# Altium project 电机控制.PrjPCB
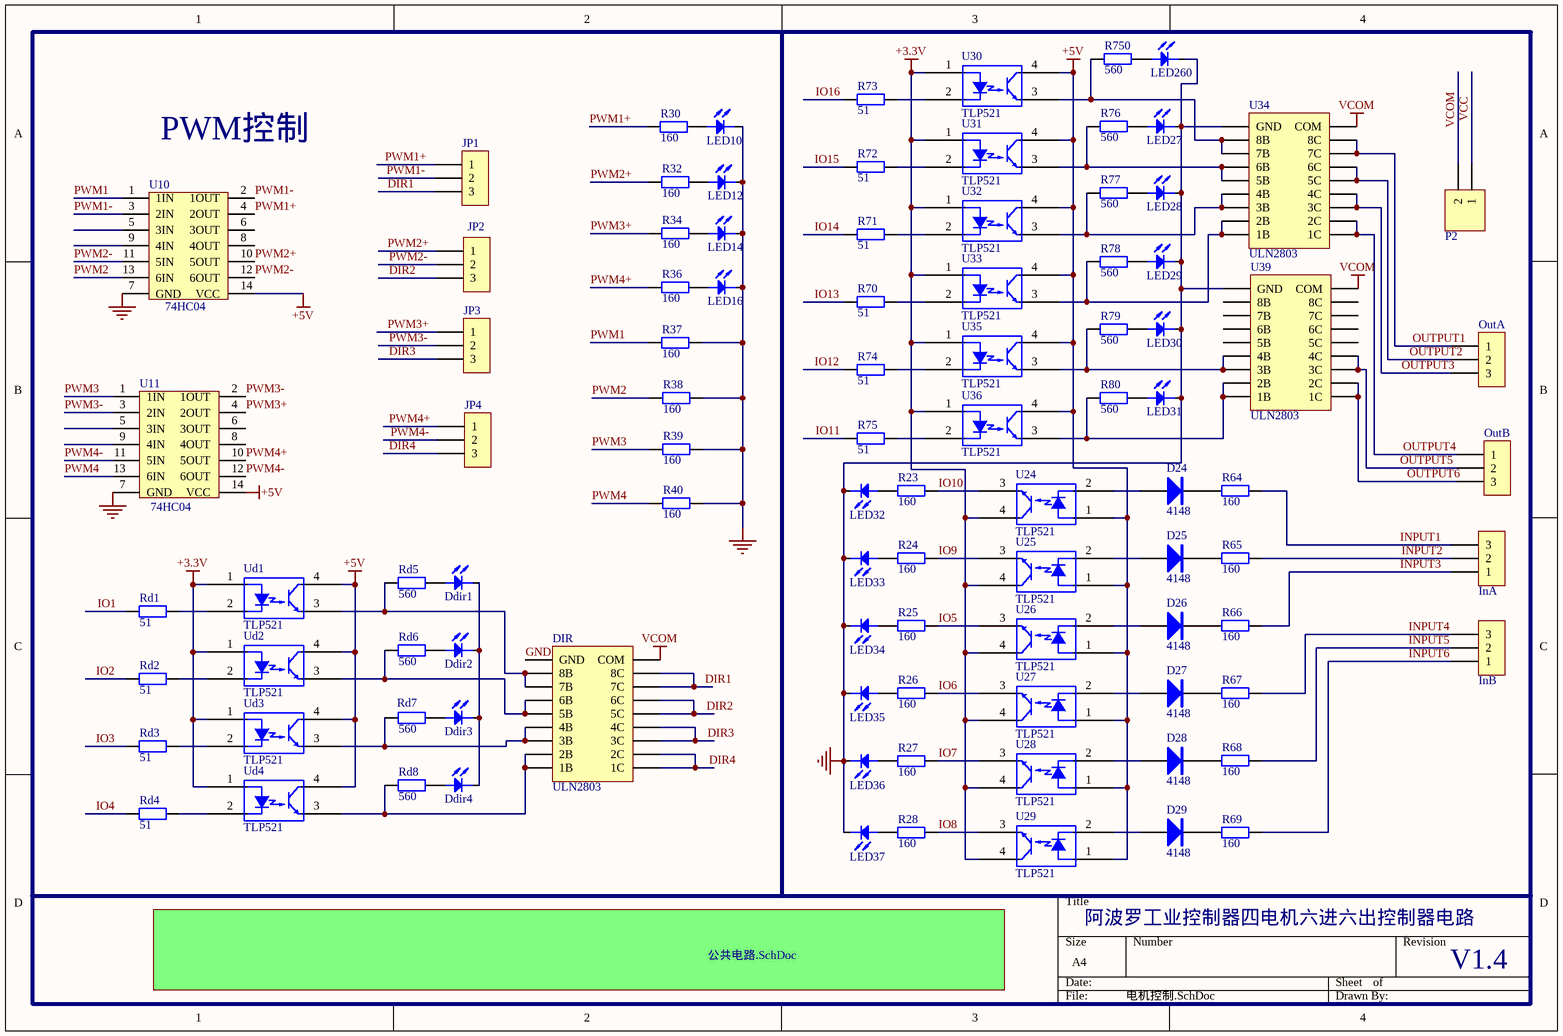
[diagram p0: 电机控制.SchDoc]
2 sheets, 169 parts. Net scope: global (net labels, ports and power ports of the same name join across sheets).
Board file: 电机控制.PcbDoc
Sheets:
  电机控制.SchDoc
     = 公共电路.SchDoc

## Sheet 电机控制.SchDoc: 阿波罗工业控制器四电机六进六出控制器电路
size A4; Revision: V1.4; SheetNumber: 0; SheetTotal: 0

### Parts
D24  4148
D25  4148
D26  4148
D27  4148
D28  4148
D29  4148
Ddir1  LED  [SMDLED]  (value not drawn)
Ddir2  LED  [SMDLED]  (value not drawn)
Ddir3  LED  [SMDLED]  (value not drawn)
Ddir4  LED  [SMDLED]  (value not drawn)
DIR  ULN2803  [sol18]
InA  CON3  (value not drawn)
InB  CON3  (value not drawn)
JP1  CON3  (value not drawn)
JP2  CON3  (value not drawn)
JP3  CON3  (value not drawn)
JP4  CON3  (value not drawn)
LED10  LED  [SMDLED]  (value not drawn)
LED12  LED  [SMDLED]  (value not drawn)
LED14  LED  [SMDLED]  (value not drawn)
LED16  LED  [SMDLED]  (value not drawn)
LED27  LED  [SMDLED]  (value not drawn)
LED28  LED  [SMDLED]  (value not drawn)
LED29  LED  [SMDLED]  (value not drawn)
LED30  LED  [SMDLED]  (value not drawn)
LED31  LED  [SMDLED]  (value not drawn)
LED32  LED  [SMDLED]  (value not drawn)
LED33  LED  [SMDLED]  (value not drawn)
LED34  LED  [SMDLED]  (value not drawn)
LED35  LED  [SMDLED]  (value not drawn)
LED36  LED  [SMDLED]  (value not drawn)
LED37  LED  [SMDLED]  (value not drawn)
LED260  LED  [SMDLED]  (value not drawn)
OutA  CON3  (value not drawn)
OutB  CON3  (value not drawn)
P2  (no value)  [HDR1X2]
R23  160  [0603A]
R24  160  [0603A]
R25  160  [0603A]
R26  160  [0603A]
R27  160  [0603A]
R28  160  [0603A]
R30  160  [0603A]
R32  160  [0603A]
R34  160  [0603A]
R36  160  [0603A]
R37  160  [0603A]
R38  160  [0603A]
R39  160  [0603A]
R40  160  [0603A]
R64  160  [0603A]
R65  160  [0603A]
R66  160  [0603A]
R67  160  [0603A]
R68  160  [0603A]
R69  160  [0603A]
R70  51  [0603A]
R71  51  [0603A]
R72  51  [0603A]
R73  51  [0603A]
R74  51  [0603A]
R75  51  [0603A]
R76  560  [0603A]
R77  560  [0603A]
R78  560  [0603A]
R79  560  [0603A]
R80  560  [0603A]
R750  560  [0603A]
Rd1  51  [0603A]
Rd2  51  [0603A]
Rd3  51  [0603A]
Rd4  51  [0603A]
Rd5  560  [0603A]
Rd6  560  [0603A]
Rd7  560  [0603A]
Rd8  560  [0603A]
U10  74HC04  [so-14]
U11  74HC04  [so-14]
U24  TLP521  [PC817]
U25  TLP521  [PC817]
U26  TLP521  [PC817]
U27  TLP521  [PC817]
U28  TLP521  [PC817]
U29  TLP521  [PC817]
U30  TLP521  [PC817]
U31  TLP521  [PC817]
U32  TLP521  [PC817]
U33  TLP521  [PC817]
U34  ULN2803  [sol18]
U35  TLP521  [PC817]
U36  TLP521  [PC817]
U39  ULN2803  [sol18]
Ud1  TLP521  [PC817]
Ud2  TLP521  [PC817]
Ud3  TLP521  [PC817]
Ud4  TLP521  [PC817]

### Sub-sheets
? = 公共电路.SchDoc: no entries

### Nets
+3.3V: U24.4(COL) U25.4(COL) U26.4(COL) U27.4(COL) U28.4(COL) U29.4(COL) U30.1(ANODE) U31.1(ANODE) U32.1(ANODE) U33.1(ANODE) U35.1(ANODE) U36.1(ANODE) Ud1.1(ANODE) Ud2.1(ANODE) Ud3.1(ANODE) Ud4.1(ANODE)
+5V: U10.14(VCC) U11.14(VCC) U24.1(ANODE) U25.1(ANODE) U26.1(ANODE) U27.1(ANODE) U28.1(ANODE) U29.1(ANODE) U30.4(COL) U31.4(COL) U32.4(COL) U33.4(COL) U35.4(COL) U36.4(COL) Ud1.4(COL) Ud2.4(COL) Ud3.4(COL) Ud4.4(COL)
GND: DIR.9(GND) LED10.K LED12.K LED14.K LED16.K LED27.K LED28.K LED29.K LED30.K LED31.K LED32.K LED33.K LED34.K LED35.K LED36.K LED37.K LED260.K R37.2 R38.2 R39.2 R40.2 U10.7(GND) U11.7(GND) U34.9(GND) U39.9(GND)
VCC: P2.1
VCOM: DIR.10(COM) P2.2 U34.10(COM) U39.10(COM)
DIR1: DIR.11(8C) DIR.12(7C) JP1.3
DIR2: DIR.13(6C) DIR.14(5C) JP2.3
DIR3: DIR.15(4C) DIR.16(3C) JP3.3
DIR4: DIR.17(2C) DIR.18(1C) JP4.3
INPUT1: InA.3 R64.2
INPUT2: InA.2 R65.2
INPUT3: InA.1 R66.2
INPUT4: InB.3 R67.2
INPUT5: InB.2 R68.2
INPUT6: InB.1 R69.2
IO1: Rd1.1
IO2: Rd2.1
IO3: Rd3.1
IO4: Rd4.1
IO5: R25.1 U26.3(EMIT)
IO6: R26.1 U27.3(EMIT)
IO7: R27.1 U28.3(EMIT)
IO8: R28.1 U29.3(EMIT)
IO9: R24.1 U25.3(EMIT)
IO10: R23.1 U24.3(EMIT)
IO11: R75.1
IO12: R74.1
IO13: R70.1
IO14: R71.1
IO15: R72.1
IO16: R73.1
OUTPUT1: OutA.1 U34.11(8C) U34.12(7C)
OUTPUT2: OutA.2 U34.13(6C) U34.14(5C)
OUTPUT3: OutA.3 U34.15(4C) U34.16(3C)
OUTPUT4: OutB.1 U34.17(2C) U34.18(1C)
OUTPUT5: OutB.2 U39.15(4C) U39.16(3C)
OUTPUT6: OutB.3 U39.17(2C) U39.18(1C)
PWM1: R37.1 U10.1(1IN)
PWM1+: JP1.1 R30.1 U10.4(2OUT)
PWM1-: JP1.2 U10.2(1OUT) U10.3(2IN)
PWM2: R38.1 U10.13(6IN)
PWM2+: JP2.1 R32.1 U10.10(5OUT)
PWM2-: JP2.2 U10.11(5IN) U10.12(6OUT)
PWM3: R39.1 U11.1(1IN)
PWM3+: JP3.1 R34.1 U11.4(2OUT)
PWM3-: JP3.2 U11.2(1OUT) U11.3(2IN)
PWM4: R40.1 U11.13(6IN)
PWM4+: JP4.1 R36.1 U11.10(5OUT)
PWM4-: JP4.2 U11.11(5IN) U11.12(6OUT)
NetD24_A: D24.A U24.2(CATH)
NetD24_K: D24.K R64.1
NetD25_A: D25.A U25.2(CATH)
NetD25_K: D25.K R65.1
NetD26_A: D26.A U26.2(CATH)
NetD26_K: D26.K R66.1
NetD27_A: D27.A U27.2(CATH)
NetD27_K: D27.K R67.1
NetD28_A: D28.A U28.2(CATH)
NetD28_K: D28.K R68.1
NetD29_A: D29.A U29.2(CATH)
NetD29_K: D29.K R69.1
NetDdir1_A: Ddir1.A Rd5.2
NetDdir1_K: Ddir1.K Ddir2.K Ddir3.K Ddir4.K
NetDdir2_A: Ddir2.A Rd6.2
NetDdir3_A: Ddir3.A Rd7.2
NetDdir4_A: Ddir4.A Rd8.2
NetDIR_1: DIR.1(1B) DIR.2(2B) Rd8.1 Ud4.3(EMIT)
NetDIR_3: DIR.3(3B) DIR.4(4B) Rd7.1 Ud3.3(EMIT)
NetDIR_5: DIR.5(5B) DIR.6(6B) Rd6.1 Ud2.3(EMIT)
NetDIR_7: DIR.7(7B) DIR.8(8B) Rd5.1 Ud1.3(EMIT)
NetLED10_A: LED10.A R30.2
NetLED12_A: LED12.A R32.2
NetLED14_A: LED14.A R34.2
NetLED16_A: LED16.A R36.2
NetLED27_A: LED27.A R76.2
NetLED28_A: LED28.A R77.2
NetLED29_A: LED29.A R78.2
NetLED30_A: LED30.A R79.2
NetLED31_A: LED31.A R80.2
NetLED32_A: LED32.A R23.2
NetLED33_A: LED33.A R24.2
NetLED34_A: LED34.A R25.2
NetLED35_A: LED35.A R26.2
NetLED36_A: LED36.A R27.2
NetLED37_A: LED37.A R28.2
NetLED260_A: LED260.A R750.2
NetR70_2: R70.2 U33.2(CATH)
NetR71_2: R71.2 U32.2(CATH)
NetR72_2: R72.2 U31.2(CATH)
NetR73_2: R73.2 U30.2(CATH)
NetR74_2: R74.2 U35.2(CATH)
NetR75_2: R75.2 U36.2(CATH)
NetR76_1: R76.1 U31.3(EMIT) U34.5(5B) U34.6(6B)
NetR77_1: R77.1 U32.3(EMIT) U34.3(3B) U34.4(4B)
NetR78_1: R78.1 U33.3(EMIT) U34.1(1B) U34.2(2B)
NetR79_1: R79.1 U35.3(EMIT) U39.3(3B) U39.4(4B)
NetR80_1: R80.1 U36.3(EMIT) U39.1(1B) U39.2(2B)
NetR750_1: R750.1 U30.3(EMIT) U34.7(7B) U34.8(8B)
NetRd1_2: Rd1.2 Ud1.2(CATH)
NetRd2_2: Rd2.2 Ud2.2(CATH)
NetRd3_2: Rd3.2 Ud3.2(CATH)
NetRd4_2: Rd4.2 Ud4.2(CATH)

Not connected (* = marked no-connect by the designer): U10 5(3IN) 6(3OUT) 8(4OUT) 9(4IN); U11 5(3IN) 6(3OUT) 8(4OUT) 9(4IN); U39 5(5B) 6(6B) 7(7B) 8(8B) 11(8C) 12(7C) 13(6C) 14(5C)

### Notes on the sheet
- (near U10) PWM控制

### Library data of the parts
P2 = Header 2: Header, 2-Pin; LatestRevisionDate: 17-Jul-2002; LatestRevisionNote: Re-released for DXP Platform.; Publisher: Altium Limited
R23-R28 R30 R32 R34 R36-R40 R64-R80 R750 Rd1-Rd8 = Res2: Resistor; Value: 1K; Published: 8-Jun-2000; LatestRevisionDate: 17-Jul-2002; LatestRevisionNote: Re-released for DXP Platform.; PackageReference: AXIAL-0.4; Publisher: Altium Limited
U24-U33 U35 U36 Ud1-Ud4 = TLP521-1: Single NPN PhotoTransistor OptoCoupler.

## Sheet 公共电路.SchDoc: 阿波罗工业控制器公共电路
size A4; Organization: *月无声智控部; Revision: V1.4; MakeTime: 2014年3月4日
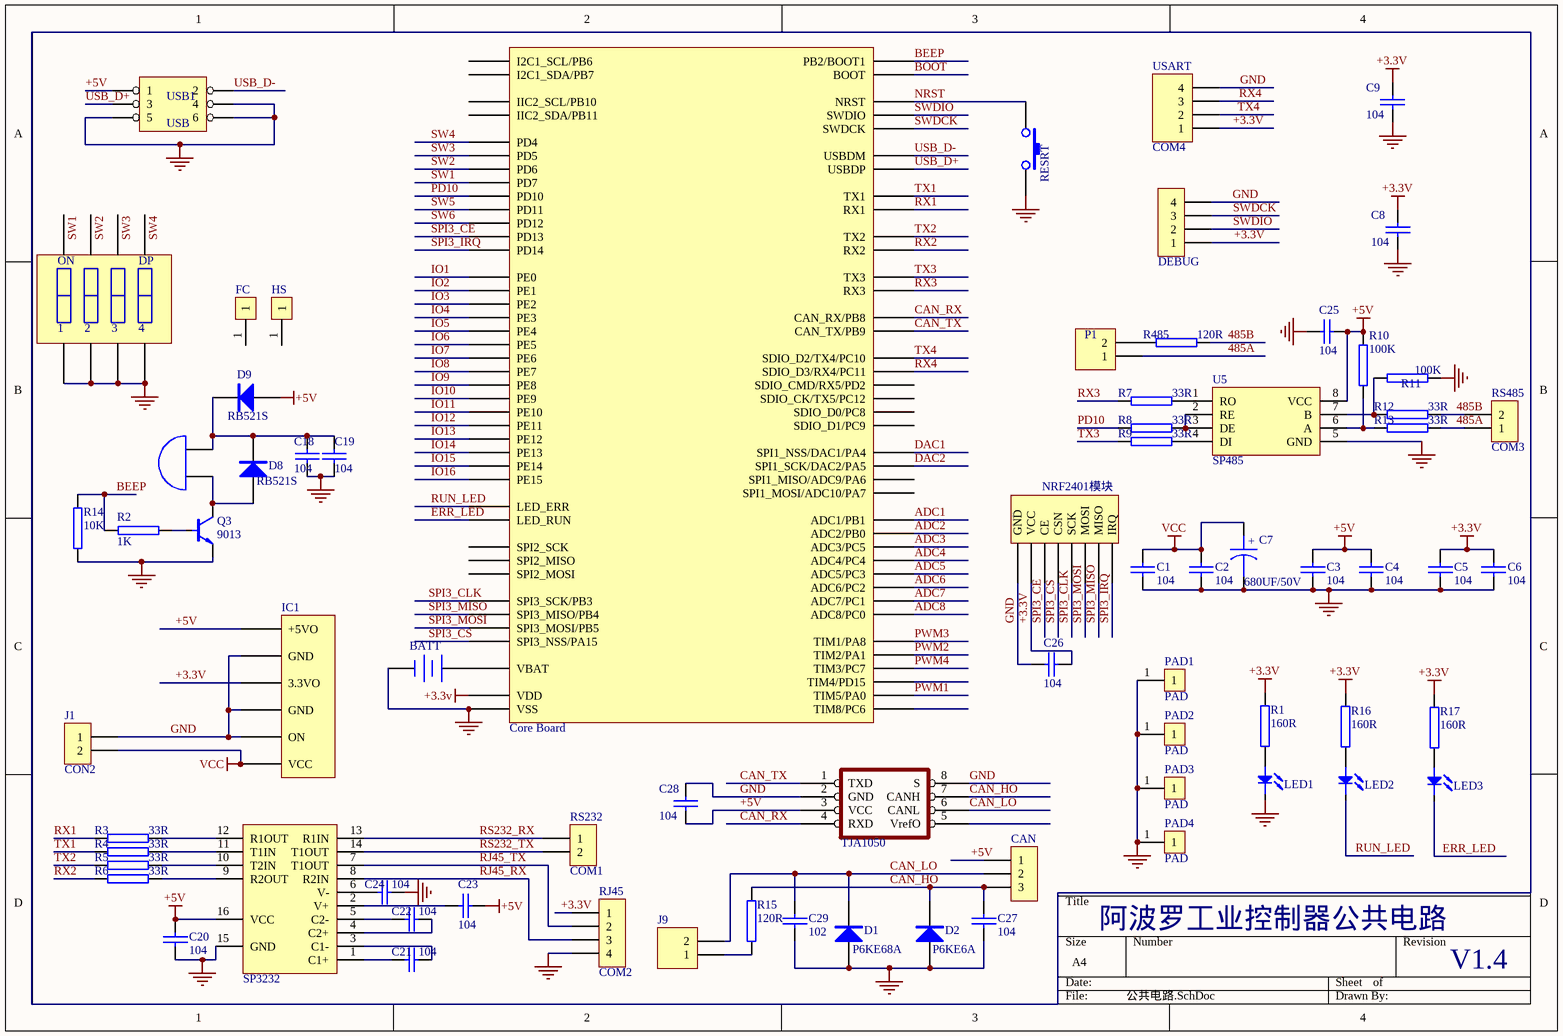
[diagram p1: 公共电路.SchDoc]

### Parts
BATT  (no value)  [MINI-BAT]
C1  104  [0603A]
C2  104  [0603A]
C3  104  [0603A]
C4  104  [0603A]
C5  104  [0603A]
C6  104  [0603A]
C7  680UF/50V  [电解电容10mm]
C8  104  [0603A]
C9  104  [0603A]
C18  104  [0603A]
C19  104  [0603A]
C20  104  [0603A]
C21  104  [0603A]
C22  104  [0603A]
C23  104  [0603A]
C24  104  [0603A]
C25  104  [0603A]
C26  104  [0603A]
C27  104  [0603A]
C28  104  [0603A]
C29  102  [0603A]
CAN  CON3  (value not drawn)
D1  P6KE68A
D2  P6KE6A
D8  RB521S
D9  RB521S
FC  (no value)  [fc]
HS  (no value)  [HS]
IC1  (no value)
IC2  Core Board  [核心板-物联网1]
J1  CON2
J2  DEBUG  [HDR1X4]
J7  NRF2401模块  [NRF24L01]
J9  (no value)  [HDR1X2]
K1  拨码开关*4  (value not drawn)
LED1  PLED  [LED2.5]  (value not drawn)
LED2  RUN  [LED2.5]  (value not drawn)
LED3  ERR  [LED2.5]  (value not drawn)
P1  (no value)  [HDR1X2]
PAD1  PAD  [PAD]
PAD2  PAD  [PAD]
PAD3  PAD  [PAD]
PAD4  PAD  [PAD]
Q3  9013  [SOT23]
R1  160R  [0603A]
R2  1K  [0603A]
R3  33R  [0603A]
R4  33R  [0603A]
R5  33R  [0603A]
R6  33R  [0603A]
R7  33R  [0603A]
R8  33R  [0603A]
R9  33R  [0603A]
R10  100K  [0603A]
R11  100K  [0603A]
R12  33R  [0603A]
R13  33R  [0603A]
R14  10K  [0603A]
R15  120R  [0603A]
R16  160R  [0603A]
R17  160R  [0603A]
R485  120R  [0603A]
RJ45  COM2  [HDR1X4]
RS232  COM1
RS485  COM3
S2  RESRT  [SW-PB2]
U3  (no value)
U4  SP3232  [TSSOP16]
U5  SP485  [SO8_L]
U6  TJA1050  [SO8_L]
USART  COM4  [HDR1X4]
USB1  USB  [USB-B3]

### Nets
+3.3V: C5.1 C6.1 C8.1 C9.1 C26.2 IC1.3(3.3VO) IC2.2(VDD) J2.1 J7.2(VCC) R1.1 R16.1 R17.1 RJ45.1 USART.1
+5V: C3.1 C4.1 C20.1 C23.2 C25.2 C28.2 CAN.1 D9.A IC1.1(+5VO) R10.2 U4.16(VCC) U5.8(VCC) U6.3(VCC) USB1.1
GND: BATT.2(-) C1.2 C2.2 C3.2 C4.2 C5.2 C6.2 C7.2 C8.2 C9.2 C18.2 C19.2 C20.2 C24.2 C25.1 C26.1 C27.2 C28.1 C29.1 D1.A D2.A IC1.2(GND) IC1.4(GND) IC1.5(ON) IC2.1(VSS) J1.1 J2.4 J7.1(GND) K1.5 K1.6 K1.7 K1.8 LED1.K PAD1.1 PAD2.1 PAD3.1 PAD4.1 Q3.2(e) R11.2 R14.1 RJ45.4 S2.2 U4.15(GND) U5.5(GND) U6.2(GND) U6.8(S) USART.4 USB1.4 USB1.5 USB1.6
VCC: C1.1 C2.1 C7.1 IC1.6(VCC) J1.2
485A: P1.1 R13.2 RS485.1
485B: R12.2 R485.2 RS485.2
ADC1: IC2.33(ADC1/PB1)
ADC2: IC2.34(ADC2/PB0)
ADC3: IC2.35(ADC3/PC5)
ADC4: IC2.36(ADC4/PC4)
ADC5: IC2.48(ADC5/PC3)
ADC6: IC2.47(ADC6/PC2)
ADC7: IC2.50(ADC7/PC1)
ADC8: IC2.49(ADC8/PC0)
BEEP: IC2.31(PB2/BOOT1) R2.1 R14.2
BOOT: IC2.3(BOOT)
CAN_HO: C27.1 CAN.3 D2.K R15.1 U6.7(CANH)
CAN_LO: C29.2 CAN.2 D1.K J9.2 U6.6(CANL)
CAN_RX: IC2.68(CAN_RX/PB8) U6.4(RXD)
CAN_TX: IC2.67(CAN_TX/PB9) U6.1(TXD)
DAC1: IC2.39(SPI1_NSS/DAC1/PA4)
DAC2: IC2.40(SPI1_SCK/DAC2/PA5)
ERR_LED: IC2.12(LED_RUN) LED3.K
IO1: IC2.58(PE0)
IO2: IC2.57(PE1)
IO3: IC2.56(PE2)
IO4: IC2.55(PE3)
IO5: IC2.54(PE4)
IO6: IC2.53(PE5)
IO7: IC2.52(PE6)
IO8: IC2.51(PE7)
IO9: IC2.30(PE8)
IO10: IC2.29(PE9)
IO11: IC2.28(PE10)
IO12: IC2.27(PE11)
IO13: IC2.26(PE12)
IO14: IC2.25(PE13)
IO15: IC2.24(PE14)
IO16: IC2.23(PE15)
NRST: IC2.4(NRST) S2.1
PD10: IC2.13(PD10) R8.1
PWM1: IC2.45(TIM5/PA0)
PWM2: IC2.46(TIM2/PA1)
PWM3: IC2.43(TIM1/PA8)
PWM4: IC2.44(TIM3/PC7)
RJ45_RX: RJ45.3 U4.8(R2IN)
RJ45_TX: RJ45.2 U4.7(T1OUT)
RS232_RX: RS232.1 U4.13(R1IN)
RS232_TX: RS232.2 U4.14(T1OUT)
RUN_LED: IC2.11(LED_ERR) LED2.K
RX1: IC2.10(RX1) R3.1
RX2: IC2.18(RX2) R6.1
RX3: IC2.20(RX3) R7.1
RX4: IC2.80(SDIO_D3/RX4/PC11) USART.3
SPI3_CE: IC2.60(PD13) J7.3(CE)
SPI3_CLK: IC2.73(SPI3_SCK/PB3) J7.5(SCK)
SPI3_CS: IC2.74(SPI3_NSS/PA15) J7.4(CSN)
SPI3_IRQ: IC2.59(PD14) J7.8(IRQ)
SPI3_MISO: IC2.72(SPI3_MISO/PB4) J7.7(MISO)
SPI3_MOSI: IC2.71(SPI3_MOSI/PB5) J7.6(MOSI)
SW1: IC2.66(PD7) K1.1
SW2: IC2.65(PD6) K1.2
SW3: IC2.64(PD5) K1.3
SW4: IC2.63(PD4) K1.4
SW5: IC2.62(PD11)
SW6: IC2.61(PD12)
SWDCK: IC2.6(SWDCK) J2.3
SWDIO: IC2.5(SWDIO) J2.2
TX1: IC2.9(TX1) R4.1
TX2: IC2.17(TX2) R5.1
TX3: IC2.19(TX3) R9.1
TX4: IC2.79(SDIO_D2/TX4/PC10) USART.2
USB_D+: IC2.8(USBDP) USB1.3
USB_D-: IC2.7(USBDM) USB1.2
NetBATT_1: BATT.1(+) IC2.32(VBAT)
NetC18_1: C18.1 C19.1 D8.K D9.K U3.1(A)
NetC21_1: C21.1 U4.1(C1+)
NetC21_2: C21.2 U4.3(C1-)
NetC22_1: C22.1 U4.5(C2-)
NetC22_2: C22.2 U4.4(C2+)
NetC23_1: C23.1 U4.2(V+)
NetC24_1: C24.1 U4.6(V-)
NetD8_A: D8.A Q3.3(c) U3.2(B)
NetJ9_1: J9.1 R15.2
NetLED1_A: LED1.A R1.2
NetLED2_A: LED2.A R16.2
NetLED3_A: LED3.A R17.2
NetP1_2: P1.2 R485.1
NetQ3_1: Q3.1(b) R2.2
NetR3_2: R3.2 U4.12(R1OUT)
NetR4_2: R4.2 U4.11(T1IN)
NetR5_2: R5.2 U4.10(T2IN)
NetR6_2: R6.2 U4.9(R2OUT)
NetR7_2: R7.2 U5.1(RO)
NetR8_2: R8.2 U5.2(RE) U5.3(DE)
NetR9_2: R9.2 U5.4(DI)
NetR10_1: R10.1 R13.1 U5.6(A)
NetR11_1: R11.1 R12.1 U5.7(B)

Not connected (* = marked no-connect by the designer): FC 1; HS 1; IC2 14(SPI2_SCK) 15(SPI2_MISO) 16(SPI2_MOSI) 21(IIC2_SDA/PB11) 22(IIC2_SCL/PB10) 37(SPI1_MISO/ADC9/PA6) 38(SPI1_MOSI/ADC10/PA7) 41(TIM8/PC6) 42(TIM4/PD15) 69(I2C1_SDA/PB7) 70(I2C1_SCL/PB6) 75(SDIO_D1/PC9) 76(SDIO_D0/PC8) 77(SDIO_CMD/RX5/PD2) 78(SDIO_CK/TX5/PC12); U6 5(VrefO)

### Notes on the sheet
- (in symbol CAPACITOR POL) +
- (in symbol 拨码开关*4) ON; DP

### Library data of the parts
BATT = Battery: XH414H; Published: 24-Mar-1999; LatestRevisionDate: 17-Jul-2002; LatestRevisionNote: Re-released for DXP Platform.; PackageReference: BAT-2; Publisher: Altium Limited; PackageDescription: Battery; 2 Leads
C1-C6 C8 C9 C18-C29 = CAP: Capacitor
C7 = CAPACITOR POL: Capacitor
FC HS = PAD
IC2 = 物联网核心板
J2 RJ45 = CON4
J9 P1 = Header 2: Header, 2-Pin; LatestRevisionDate: 17-Jul-2002; LatestRevisionNote: Re-released for DXP Platform.; Publisher: Altium Limited
LED1-LED3 = LED
Q3 = NPN
R1-R17 R485 = RES2
RS232 RS485 = CON2
S2 = SW-PB
U4 = SP3232EEA
USART = Header 4: Header, 4-Pin; LatestRevisionDate: 17-Jul-2002; LatestRevisionNote: Re-released for DXP Platform.; Publisher: Altium Limited
USB1 = HEADER 3X2

## Nets that join several sheets
+3.3V: 电机控制 (16 pins), 公共电路 (14 pins)
+5V: 电机控制 (18 pins), 公共电路 (14 pins)
GND: 电机控制 (25 pins), 公共电路 (50 pins)
VCC: 电机控制 (P2.1), 公共电路 (5 pins)
IO1: 电机控制 (Rd1.1), 公共电路 (IC2.58)
IO2: 电机控制 (Rd2.1), 公共电路 (IC2.57)
IO3: 电机控制 (Rd3.1), 公共电路 (IC2.56)
IO4: 电机控制 (Rd4.1), 公共电路 (IC2.55)
IO5: 电机控制 (R25.1 U26.3), 公共电路 (IC2.54)
IO6: 电机控制 (R26.1 U27.3), 公共电路 (IC2.53)
IO7: 电机控制 (R27.1 U28.3), 公共电路 (IC2.52)
IO8: 电机控制 (R28.1 U29.3), 公共电路 (IC2.51)
IO9: 电机控制 (R24.1 U25.3), 公共电路 (IC2.30)
IO10: 电机控制 (R23.1 U24.3), 公共电路 (IC2.29)
IO11: 电机控制 (R75.1), 公共电路 (IC2.28)
IO12: 电机控制 (R74.1), 公共电路 (IC2.27)
IO13: 电机控制 (R70.1), 公共电路 (IC2.26)
IO14: 电机控制 (R71.1), 公共电路 (IC2.25)
IO15: 电机控制 (R72.1), 公共电路 (IC2.24)
IO16: 电机控制 (R73.1), 公共电路 (IC2.23)
PWM1: 电机控制 (R37.1 U10.1), 公共电路 (IC2.45)
PWM2: 电机控制 (R38.1 U10.13), 公共电路 (IC2.46)
PWM3: 电机控制 (R39.1 U11.1), 公共电路 (IC2.43)
PWM4: 电机控制 (R40.1 U11.13), 公共电路 (IC2.44)